# EAGLE design RJ11_BoshBaro_HwellHyg (EAGLE 6.3)
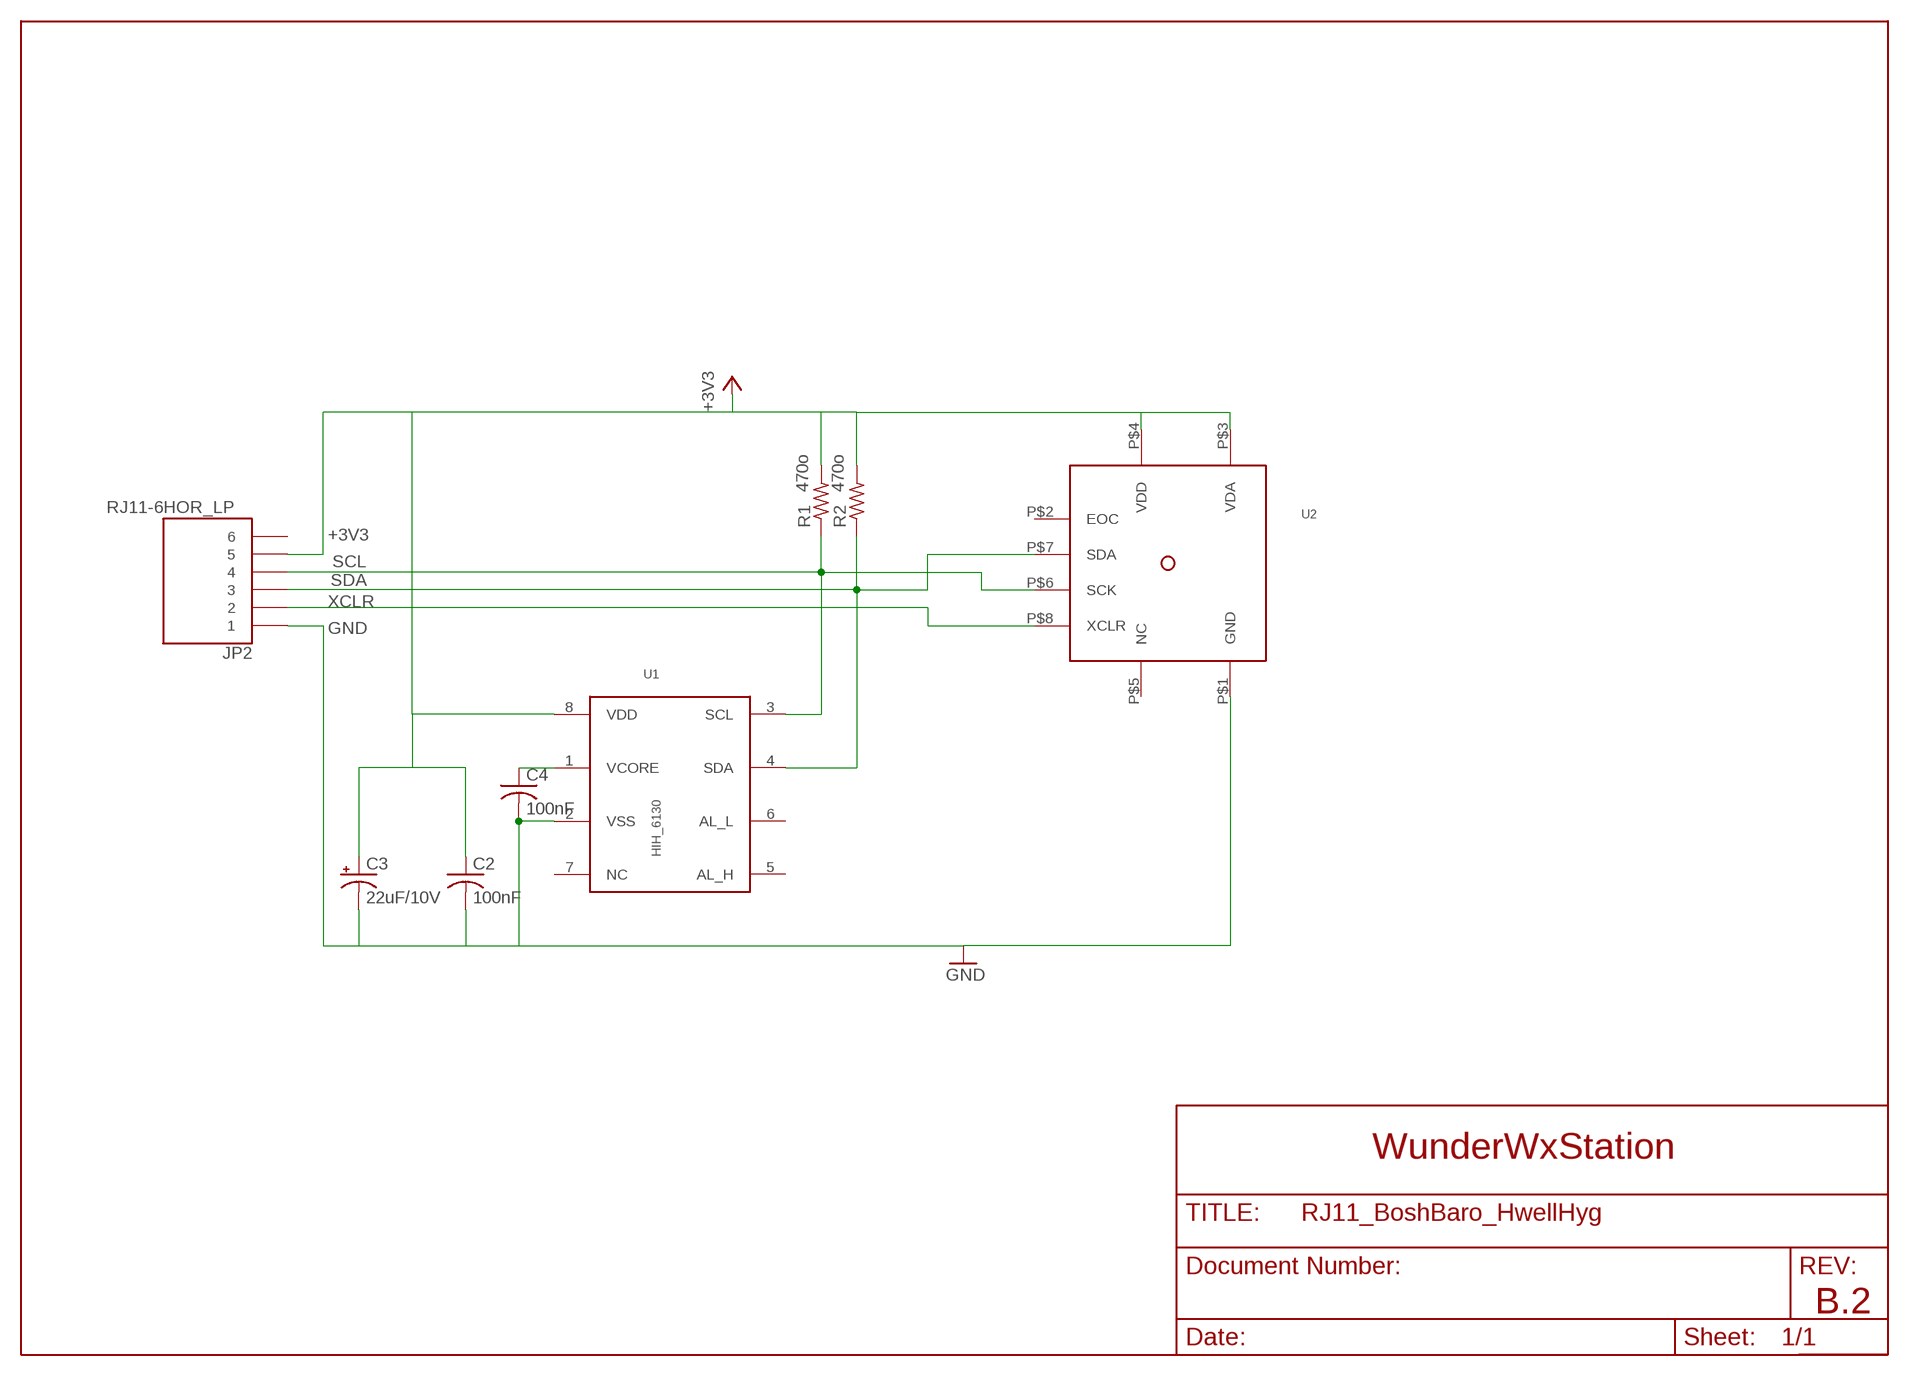
[diagram p0: schematic, sheet 1]

## Parts
C2  100nF  C-USC0805K  [C0805K]
C3  22uF/10V  CPOL-USSMCB  [SMC_B]
C4  100nF  C-USC0805K  [C0805K]
JP2  RJ11-6HOR_LP  [RJ11_HOR_LP]
R1  470o  R-US_R0603  [R0603]
R2  470o  R-US_R0603  [R0603]
U1  HIH_6130  [SOIC8]
U2  BMP085  [LCC8]

## Nets
+3V3: C2.1 C3.+ JP2.P$5 R1.2 R2.2 U1.8(VDD) U2.P$3(VDA) U2.P$4(VDD)
GND: C2.2 C3.- C4.2 JP2.P$1 U1.2(VSS) U2.P$1(GND)
N$2: C4.1 U1.1(VCORE)
SCL: JP2.P$4 R1.1 U1.3(SCL) U2.P$6(SCK)
SDA: JP2.P$3 R2.1 U1.4(SDA) U2.P$7(SDA)
XCLR: JP2.P$2 U2.P$8(XCLR)
Unconnected: JP2.P$6 U1.5(AL_H) U1.6(AL_L) U1.7(NC) U2.P$2(EOC) U2.P$5(NC)

## Notes on the sheet
- WunderWxStation
- B.2

## Library data of the parts
C2 C4 = rcl:C-US: CAPACITOR, American symbol
C3 = rcl:CPOL-US: POLARIZED CAPACITOR, American symbol
JP2 = wifi_WX:RJ11-6: Cat3, RJ11 6 pin socket
R1 R2 = rcl:R-US_: RESISTOR, American symbol
U1 = Stofer:HIH_6130
U2 = 1AA_Stofer:BMP085

## Board
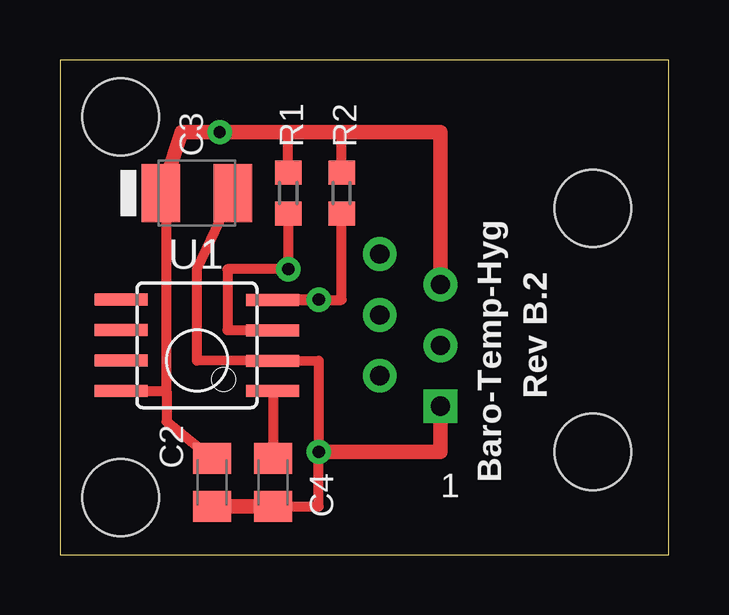
[diagram p1: board, top side]
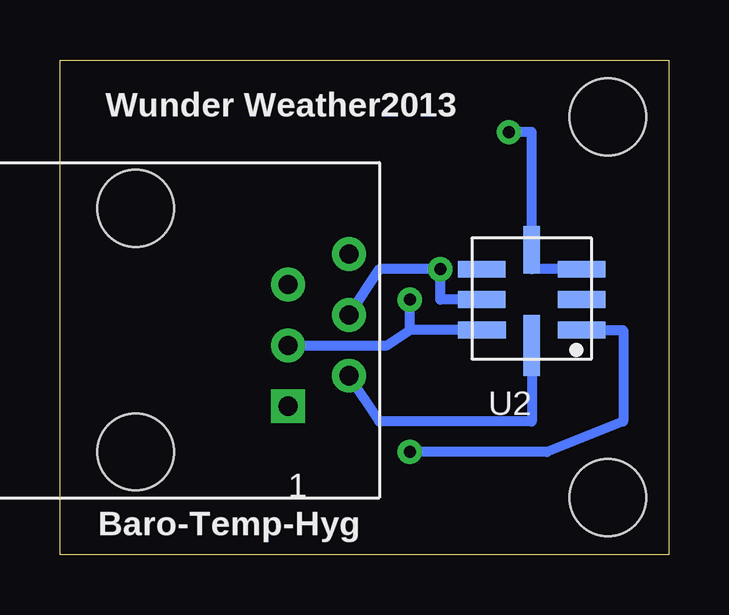
[diagram p2: board, bottom side, seen from below]

Size 25.38 x 20.62 mm. Coordinates in mm from the lower left corner, seen from the top.
Outline: 0,0 25.38,0 25.38,20.62 0,20.62 0,0
Copper layers (1*16): Top 0.035mm / dielectric 1.5mm / Bottom 0.035mm
Design rules "sparkfun": minimum track width 8mil, minimum drill 20mil, track to track 8mil, track to pad 8mil, pad to pad 8mil, via to via 8mil, smd to smd 8mil, copper to edge 10mil, drill to drill 8mil, minimum pad ring 12mil, minimum via ring 10mil, stop-mask expansion 4mil, vias tented up to drill 25mil, thermal gap 10mil
Holes 3.2 mm at 2.54,18.25 2.54,2.38

### Footprints (pad centres in the part's own frame; a part is rotated, then mirrored left to right if it is on the bottom)
C0805K = smd 1.3 x 1.6: 1 -1,0; 2 1,0
SMC_B = smd 1.6 x 2.4: + -1.5,0; - 1.5,0
RJ11_HOR_LP = drill 0.8 square: P$1 3.175,7.62 | drill 0.8: P$2 1.905,10.16; P$3 0.635,7.62; P$4 -0.635,10.16; P$5 -1.905,7.62; P$6 -3.175,10.16 | hole 3.2: -5.08,1.27; 5.08,1.27
R0603 = smd 1 x 1.1: 1 -0.85,0; 2 0.85,0
SOIC8 = smd 0.5 x 2.2: 1 -1.905,-3.154; 2 -0.645,-3.154; 3 0.625,-3.154; 4 1.895,-3.154; 5 1.905,3.154; 6 0.635,3.154; 7 -0.635,3.154; 8 -1.905,3.154
LCC8 = smd 1.981 x 0.7: P$1 -0.178,0; P$2 -0.178,-1.27; P$3 -0.178,-2.54; P$5 3.988,-2.54; P$6 3.988,-1.27 | smd 0.7 x 1.981: P$4 1.905,-3.353 | smd 2.007 x 0.7: P$7 3.988,0 | smd 0.7 x 2.55: P$8 1.905,0.635

### Placement (x,y rotation side)
C2  6.34,3.01 270 top
C3  5.71,15.08 0 top
C4  8.89,3.01 270 top
JP2  23.49,9.36 270 bottom
R1  9.52,15.08 90 top
R2  11.74,15.08 90 top
U1  5.71,8.73 90 top
U2  3.81,9.36 180 bottom

### Tracks (layer width: path | path; a pad name or v marks a point on that pad's centre or on a via)
+3V3  (via drill 0.51)
  Top 0.406: U1.8 4.44,6.82 | 4.44,6.82 4.44,14.44 | 4.44,14.44 4.44,15.71 | R1.2 9.52,17.61 | 4.44,6.82 4.44,5.55 C2.1 | C3.+ 4.44,14.44 | R2.2 11.74,17.61 12.06,17.61
  Top 0.61: 4.44,15.71 5.08,17.61 v6.66,17.61 9.52,17.61 12.06,17.61 15.87,17.61 JP2.P$5
  Bottom 0.406: U2.P$3 5.71,11.9 U2.P$4 5.71,17.61 v6.66,17.61
GND  (via drill 0.51)
  Top 0.406: C3.- 5.71,11.9 5.71,8.09 U1.2 10.79,8.09 v10.79,4.28 10.79,2.01 C2.2
  Top 0.61: C2.2 C4.2 | JP2.P$1 15.87,4.28 v10.79,4.28
  Bottom 0.406: U2.P$1 1.9,9.36 1.9,5.55 5.08,4.28 v10.79,4.28
N$2
  Top 0.406: U1.1 8.89,6.82 | 9.52,6.82 8.89,6.82 | 8.89,6.82 C4.1
SCL  (via drill 0.51)
  Top 0.406: R1.1 v9.52,11.9 6.98,11.9 6.98,9.36 U1.3
  Bottom 0.406: U2.P$6 9.52,10.63 v9.52,11.9 12.06,11.9 JP2.P$4
SDA  (via drill 0.51)
  Top 0.406: U1.4 9.52,10.62 | 9.52,10.62 v10.78,10.62 | v10.78,10.62 v10.79,10.63 9.52,10.63 9.52,10.62 | v10.78,10.62 11.74,10.62 R2.1
  Bottom 0.406: U2.P$7 10.79,9.36 | 10.79,9.36 v10.79,10.63 | JP2.P$3 11.74,8.73 10.79,9.36
XCLR
  Bottom 0.406: U2.P$8 5.71,5.55 12.06,5.55 JP2.P$2

### Text on the board
tPlace: Rev B.2 | Baro-Temp-Hyg | 1
bPlace: Wunder Weather2013 | 1 | Baro-Temp-Hyg
_bsilk: U2